# Altium schematic sheet vidaq.SchDoc
size A4; SheetNumber: 1; SheetTotal: 1
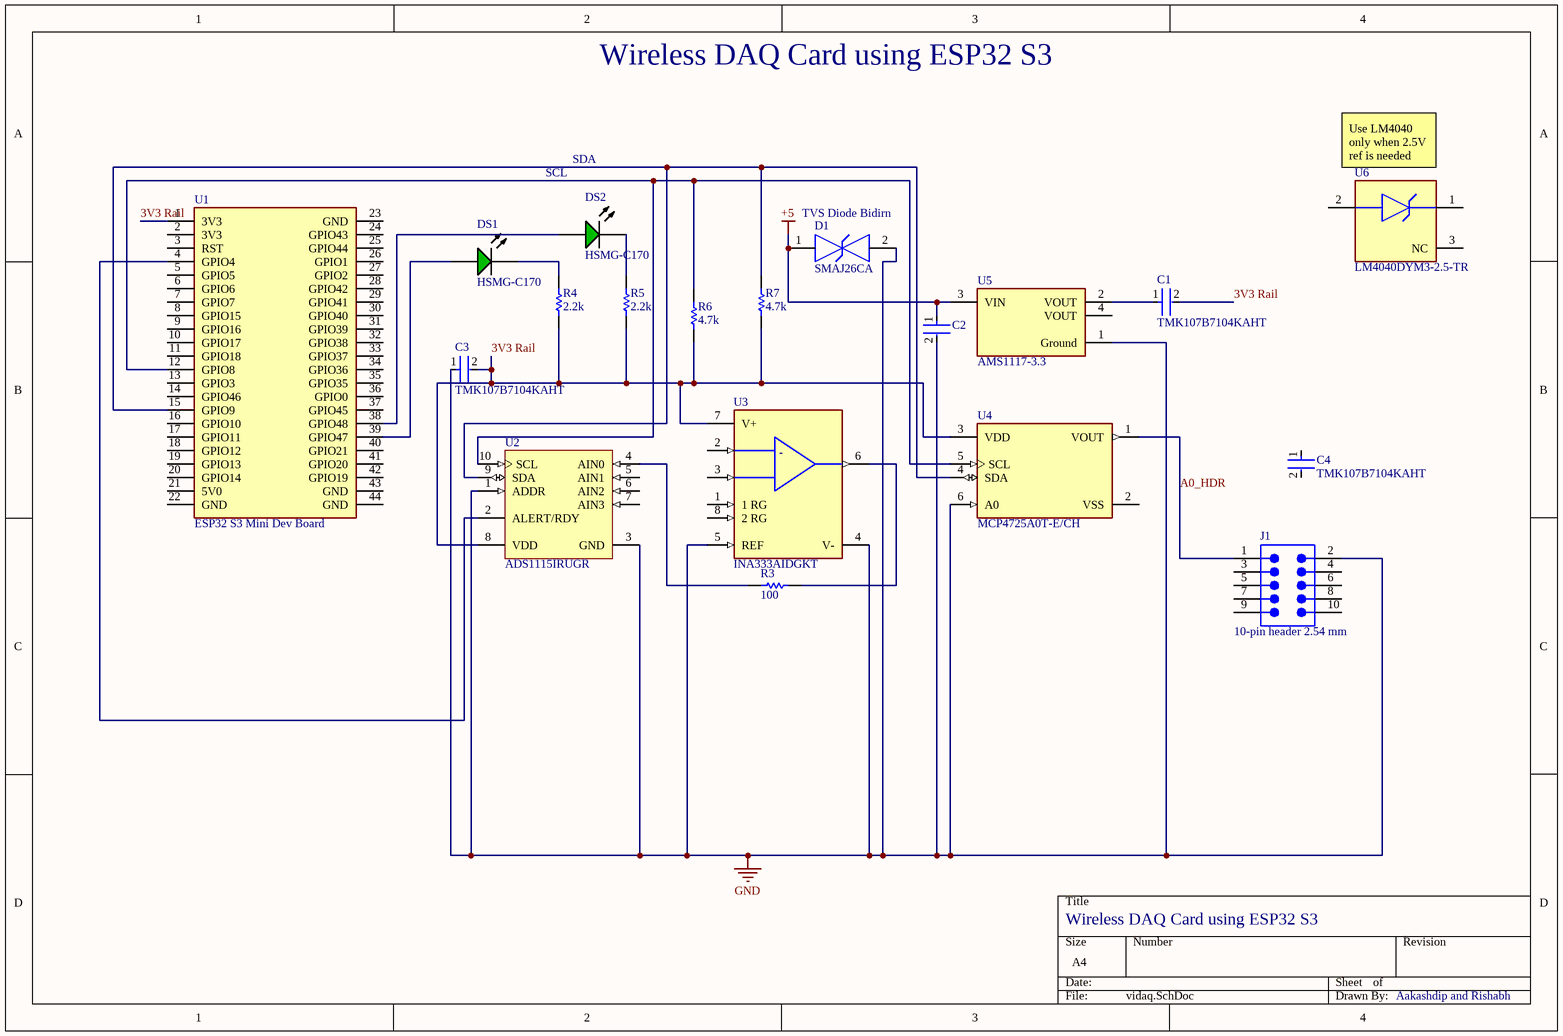
[diagram p0: vidaq.SchDoc]

## Parts
C1  TMK107B7104KAHT  [FP-0603-L_1_6_0_1-W_0_8_0-IPC_C]
C2  TMK107B7104KAHT  [FP-0603-L_1_6_0_1-W_0_8_0-IPC_C]  (value not drawn)
C3  TMK107B7104KAHT  [FP-0603-L_1_6_0_1-W_0_8_0-IPC_C]
C4  TMK107B7104KAHT  [FP-0603-L_1_6_0_1-W_0_8_0-IPC_C]
D1  SMAJ26CA  [FP-SMAJ-CA-MFG]
DS1  HSMG-C170  [AVAG-HSMX-C170_V]
DS2  HSMG-C170  [AVAG-HSMX-C170_V]
J1  10-pin header 2.54 mm  [61031021121]
R3  100  [RESC1005X40X25NL05T10]
R4  2.2k  [RESC0402(1005)_N]
R5  2.2k  [RESC0402(1005)_N]
R6  4.7k  [RESC1210(3225)_N]
R7  4.7k  [RESC1210(3225)_N]
U1  ESP32 S3 Mini Dev Board  [ESP32-S3-DEVKITM-1-N8]
U2  ADS1115IRUGR  [TI-RUG10_V]
U3  INA333AIDGKT  [FP-DGK0008A-MFG]
U4  MCP4725A0T-E/CH  [FP-C04-028-CHY-IPC_A]
U5  AMS1117-3.3  [FP-AMS1117-IPC_C]
U6  LM4040DYM3-2.5-TR  [FP-SOT23-3LD-PL-1-MFG]

## Nets
+5: C2.1 D1.1 U5.3(VIN)
GND: C2.2 C3.1 D1.2 J1.2 U2.1(ADDR) U2.3(GND) U3.4(V-) U3.5(REF) U4.6(A0) U5.1(Ground)
3V3 Rail: C1.2 C3.2 R4.1 R5.1 R6.1 R7.1 U1.1(3V3) U2.8(VDD) U3.7(V+) U4.3(VDD)
A0_HDR: J1.1 U4.1(VOUT)
NetC1_1: C1.1 U5.2(VOUT)
NetDS1_1: DS1.1(A) U1.39(GPIO47)
NetDS1_2: DS1.2(K) R4.2
NetDS2_1: DS2.1(A) U1.38(GPIO48)
NetDS2_2: DS2.2(K) R5.2
NetR3_1: R3.1 U2.4(AIN0)
NetR3_2: R3.2 U3.6(VOUT)
NetR6_2: R6.2 U1.12(GPIO8) U2.10(SCL) U4.5(SCL)
NetR7_2: R7.2 U1.15(GPIO9) U2.9(SDA) U4.4(SDA)
NetU1_4: U1.4(GPIO4) U2.2(ALERT/RDY)

Not connected (* = marked no-connect by the designer): C4 1 2; J1 3 4 5 6 7 8 9 10; U1 2(3V3) 3(RST) 5(GPIO5) 6(GPIO6) 7(GPIO7) 8(GPIO15) 9(GPIO16) 10(GPIO17) 11(GPIO18) 13(GPIO3) 14(GPIO46) 16(GPIO10) 17(GPIO11) 18(GPIO12) 19(GPIO13) 20(GPIO14) 21(5V0) 22(GND) 23(GND) 24(GPIO43) 25(GPIO44) 26(GPIO1) 27(GPIO2) 28(GPIO42) 29(GPIO41) 30(GPIO40) 31(GPIO39) 32(GPIO38) 33(GPIO37) 34(GPIO36) 35(GPIO35) 36(GPIO0) 37(GPIO45) 40(GPIO21) 41(GPIO20) 42(GPIO19) 43(GND) 44(GND); U2 5(AIN1) 6(AIN2) 7(AIN3); U3 1(1_RG) 2(VIN-) 3(VIN+) 8(2_RG); U4 2(VSS); U5 4(VOUT); U6 1(+) 2(-) 3(NC)

## Notes on the sheet
- Wireless DAQ Card using ESP32 S3
- SCL
- SDA
- (near U6) Use LM4040 only when 2.5V ref is needed
- (near D1) TVS Diode Bidirn
- Aakashdip and Rishabh
- (in symbol CMP-0944-00090-3) -

## Library data of the parts
C1-C4 = CMP-14477-001640-2: None; Dielectric: X7R; Tolerance: 10%; Voltage Rating (DC): 25V; Capacitance: 100nF; Mount: Surface Mount; Thickness: 0.035inch; Packaging: Tape and Reel; Termination: SMD/SMT; Halogen Free: Halogen Free; RoHS Compliant: Yes; Case Code (Metric): 1608; Min Operating Temperature: -55°C; Width: 0.031inch; Voltage Rating: 25V; Package Quantity: 1; Case Code (Imperial): 0603; Ratings: AEC-Q200; Lead Free: Lead Free; Length: 0.063inch; Height: 0.8mm; Case/Package: 0603; Max Operating Temperature: 125°C
D1 = CMP-08607-000031-1: TVS DIODE 26V 42.1V DO214AC; Manufacturer: Littelfuse Inc; Direction: Bidirectional; Max Junction Temp: +150°C; Peak Pulse Power: 400W; Peak Pulse Current: 9.5A; Number Of Channels: 1; Breakdown Voltage: 28.9V; Temperature: -65°C to +150°C; Temperature Range Low: -65°C; Octopart: https://octopart.com/smaj26ca-littelfuse-350028; Category: Diode; Automotive: No; Mouser Description: SMAJ Series 42.1 V 0.4 kW Surface Mount Bi-Directional TVS Diode - DO-214AC; Package: SMAJ-CA; ComponentLink2Description: Datasheet; Device Class L1: Circuit Protection; Manufacturer Part Number: SMAJ26CA; Temperature Range High: +150°C; Device Class L3: unset; Reverse Standoff Voltage: 26V; Digikey Description: TVS DIODE 26V 42.1V DO214AC; Lead Free: Yes; Clamping Voltage: 42.1V; Device Class L2: TVS Diodes; RoHS: TRUE; Height: 2.29mm; ComponentLink2URL: https://www.littelfuse.com/~/media/electronics/datasheets/tvs_diodes/littelfuse_tvs_diode_smaj_datasheet.pdf.pdf
DS1 DS2 = CMP-2000-05062-1: Chip LED, Green, 2.2 V, -40 to 85 degC, 2-Pin SMD, Pb-Free, Tape and Reel; Manufacturer: Avago; No. of Pins: 2; Peak Wavelength: 570nm; SVHC: NoSVHC(16-Jun-2014); Dominant Wavelength: 572nm; Forward Current If: 20mA; Viewing Angle: 170deg; Lens Shape: Rectangular; PIV Max: 5V; External Width: 1.25mm; LED Type: Standard; External Depth: 0.8mm; Opto Mounting Orientation: Top; Luminous Intensity: 15mcd; Luminous Intensity Min: 4mcd; Forward Voltage VF Max: 2.6V; External Length / Height: 2mm; Bulb Size: 1.25mmx1.4mm; Light Area Height: 1mm; Voltage Vf Typ: 2.2V; Operating Temperature Max: 85degC; Datasheet Version: Oct-08; MSL: MSL2A-4weeks; Peak Forward Current: 20mA; Package Description: 2-Pin Surface Mount Device, Body 2 x 1.25 mm, Height 0.8 mm; Datasheet URL: https://datasheet.ciiva.com/29280/180495-da-01-en-chip-led-hsmg-c170-gelb-gruen-29280971.pdf; Storage Temperature Min: -40degC; LED Colour: Green; Wavelength Typ: 570nm; Mounting Type: SMD; Forward Current If Max: 20mA; Dominant Wavelength Typ: 572nm; LED Mounting: SMD; Operating Temperature Range: -30degCto+85degC; Operating Temperature Min: -30degC; Manufacturer URL: http://www.avagotech.com/; Packaging: CutTape; Luminous Intensity Typ: 15mcd; Package Reference: HSMX-C170; Storage Temperature Max: 85degC; Opto Case Style: SMD; Forward Voltage: 2.2V
J1 = CMP-1502-01053-3: NexarPartId: 32855451; Current Rating: 3A; Row Spacing: 2.54mm; Connector Type: Male Pin; Number of Contacts: 10; Operating Supply Voltage: 250V; Contact Resistance: 20mΩ; Gender: Male; Pitch: 2.54mm; Color: Black; Orientation: Vertical; Packaging: Tape and Reel; Mount: Surface Mount; Number of Rows: 2; Number of Positions: 10; Contact Mating Length: 5.9944mm; Number of Pins: 10; Contact Material: Copper; Contact Plating: Gold; Termination: Solder; Lead Pitch: 2.54mm; REACH SVHC: Unknown; RoHS: Compliant
R3 = CMP-2002-07914-1: 100ohm 0402 RC0402JR-07100RL; Manufacturer: Yageo / Phycomp; Part Number: RC0402JR-07100RL
R4 R5 = CMP-1011-00082-1: 2K2 0.063W 5% 0402 (1005 Metric)  SMD; Value: 2200.00 Ohm; Case-EIA: 0402; Case-Metric: 1005; Tolerance: 5 %; Power: 0.063 W; Technology: SMT
R6 R7 = CMP-1015-00090-1: 4K7 0.5W 5% 1210 (3225 Metric)  SMD; Value: 4700.00 Ohm; Case-Metric: 3225; Case-EIA: 1210; Technology: SMT; Tolerance: 5 %; Power: 0.5 W
U1 = 1965-ESP32-S3-DEVKITM-1-N8-ND: ESP32-S3-MINI-1-N8 ESP32-S Transceiver; 802.11 b/g/n (Wi-Fi, WiFi, WLAN), Bluetooth® 5.x (BLE) 2.4GHz Evaluation Board; DigiKey Part Number: 1965-ESP32-S3-DEVKITM-1-N8-ND
U2 = CMP-0003-00970-1: 16-Bit ADC with Integrated Multiplexer, PGA, Comparator, Oscillator, and Reference, -40 to 125 degC, 10-pin HandDrawn (RUG10), Green (RoHS & no Sb/Br); Manufacturer: Texas Instruments; Analog Voltage AV/DD(Max)(V): 5.5; Analog Voltage AV/DD(Min)(V): 2; Sample Rate (max)(SPS): 860; Resolution(Bits): 16; Architecture: Delta-Sigma; INL(Max)(+/-LSB): 1; Interface: Serial I2C; # Input Channels: 4; SubFamily: Precision ADC (<=10MSPS); ComponentLink3URL: http://www.ti.com/litv/pdf/mpqf216a; Digital Supply(Min)(V): 2; Digital Supply(Max)(V): 5.5; PackageReference: RUG10; Eco-Plan: Green (RoHS & no Sb/Br); DatasheetVersion: SBAS444B; ComponentLink2Description: Datasheet; ComponentLink2URL: http://www.ti.com/general/docs/lit/getliterature.tsp?genericPartNumber=ADS1115&fileType=pdf; PackageVersion: 4208528-3/B, 04/2008; ComponentLink3Description: Package Specification; ComponentLink1Description: Manufacturer URL; PartNumber: ADS1115IRUGR; ComponentLink1URL: http://www.ti.com/; PackageDescription: 10-Pin Plastic Quad Flatpack, Body 1.5 x 2 mm, Pitch 0.5 mm; Mounting Technology: Surface Mount; Code_JEDEC: MO-288
U3 = CMP-0944-00090-3: IC INST AMP 1 CIRCUIT 8VSSOP; Manufacturer: Texas Instruments; Min Dual Supply Voltage: 0.9V; Max Junction Temp: +150°C; Max Dual Supply Voltage: 2.75V; Input Bias Current: 0.00007uA; Standoff Height: 0.05mm; Nominal Supply Current: 50uA; Number Of Channels: 1; Voltage Gain: 0.001-1V/mV; Max Supply Voltage: 5.5V; Import Ts: 1521844208; Input Offset Voltage: 0.010-0.025mV; Bandwidth: 150kHz; Min Supply Voltage: 1.8V; Ciiva Ids: 1154636; Device Class L1: Integrated Circuits (ICs); Temperature Range High: +125°C; Automotive: No; Ambient Temperature Range Low: -40°C; Height: 1.1mm; Mouser Description: Instrumentation Amplifiers Lo Pwr Prec Inst Amp; Release Date: 1464176905; Temperature: -40°C to +125°C; Device Class L2: Linear ICs; Temperature Range Low: -40°C; Octopart: https://octopart.com/ina333aidgkt-texas+instruments-8315938; ComponentLink2URL: http://www.ti.com/lit/ds/symlink/ina333.pdf; Lead Free: Yes; Category: IC; Package: DGK0008A; ComponentLink2Description: Datasheet; Digikey Description: IC INST AMP 1 CIRCUIT 8VSSOP; Manufacturer Part Number: INA333AIDGKT; Ambient Temperature Range High: +125°C; Device Class L3: Instrumentation; RoHS: TRUE
U4 = CMP-0188-00760-3: IC DAC 12BIT V-OUT SOT23-6; Number of Outputs: 1; Supply Type: Single; Integral Nonlinearity (INL): 14.5LSB; Polarity: Unipolar; Number of Bits: 12; Min Supply Voltage: 2.7V; Output Type: Voltage; Settling Time: 6us; Max Supply Voltage: 5.5V; Nominal Supply Current: 210uA; Resolution: 12b; Interface: I2C; Input Offset Voltage (Vos): 1.1mV; Radiation Hardening: No; Number of DAC Channels: 1; Length: 3.1mm; Number of D/A Converters: 1; Number of Pins: 6; Case/Package: SOT-23-6; Lead Free: Lead Free; Number of Channels: 1; Termination: SMD/SMT; Width: 1.8mm; Contact Plating: Tin; Package Quantity: 3000; Max Operating Temperature: 125°C; Min Operating Temperature: -40°C; REACH SVHC: No SVHC; Mount: Surface Mount; Height: 1.3mm; Packaging: Tape and Reel; Number of Converters: 1
U5 = CMP-209535-000001-1: LDO Voltage Regulators 1A, 3.3V; Manufacturer: Advanced Monolithic Systems; Dropout Voltage: 1.1V; Output Type: Fixed; Nominal Supply Current: 5mA; Max Power Dissipation: 1.2W; Max Supply Voltage: 15V; Number Of Outputs: 1; Standoff Height: 0.64mm; Max Junction Temp: +125°C; Height: 1.8mm; Package: AMS1117; Device Class L2: Power Management ICs; ComponentLink2Description: Datasheet; ComponentLink2URL: http://www.advanced-monolithic.com/pdf/ds1117.pdf; Category: IC; RoHS: TRUE; Automotive: No; Device Class L1: Integrated Circuits (ICs); Output Current: 1A; Device Class L3: Voltage Regulators - Linear; Temperature: -40°C to +125°C; Output Voltage: 3.3V; Manufacturer Part Number: AMS1117-3.3; Temperature Range Low: -40°C; Octopart: https://octopart.com/ams1117-3.3-advanced+monolithic+systems-25899300; Lead Free: Yes; Ipc Land Pattern Name: SOT229P700X180-4; Temperature Range High: +125°C
U6 = CMP-06323-000001-1: IC VREF SHUNT 1% SOT23-3; Manufacturer: Microchip; Nominal Supply Current: 45uA; Max Power Dissipation: 306mW; Standoff Height: 0.013mm; Output Type: Fixed; Output Voltage: 2.5V; Number Of Outputs: 1; ComponentLink2Description: Datasheet; Package: SOT23-3LD-PL-1; ComponentLink2URL: http://ww1.microchip.com/downloads/en/DeviceDoc/LM4040-41-Precision-Micropower-Shunt-Voltage-Reference-DS20005757B.pdf; Device Class L3: Voltage References; Device Class L2: Power Management ICs; Temperature Range High: +85°C; Ambient Temperature Range Low: -40°C; RoHS: TRUE; Octopart: https://octopart.com/lm4040dym3-2.5-tr-microchip-66800126; Height: 1.11mm; Category: IC; Manufacturer Part Number: LM4040DYM3-2.5-TR; Temperature Range Low: -40°C; Temperature: -40°C to +85°C; Reference Type: Shunt; Digikey Description: IC VREF SHUNT 1% SOT23-3; Lead Free: Yes; Automotive: No; Device Class L1: Integrated Circuits (ICs); Mouser Description: LM4040 Series 2.5 V ±1 % Precision Micropower Shunt Voltage Reference - SOT-23; Ambient Temperature Range High: +85°C